# EAGLE design pi_shield_R4 (EAGLE 6.4)
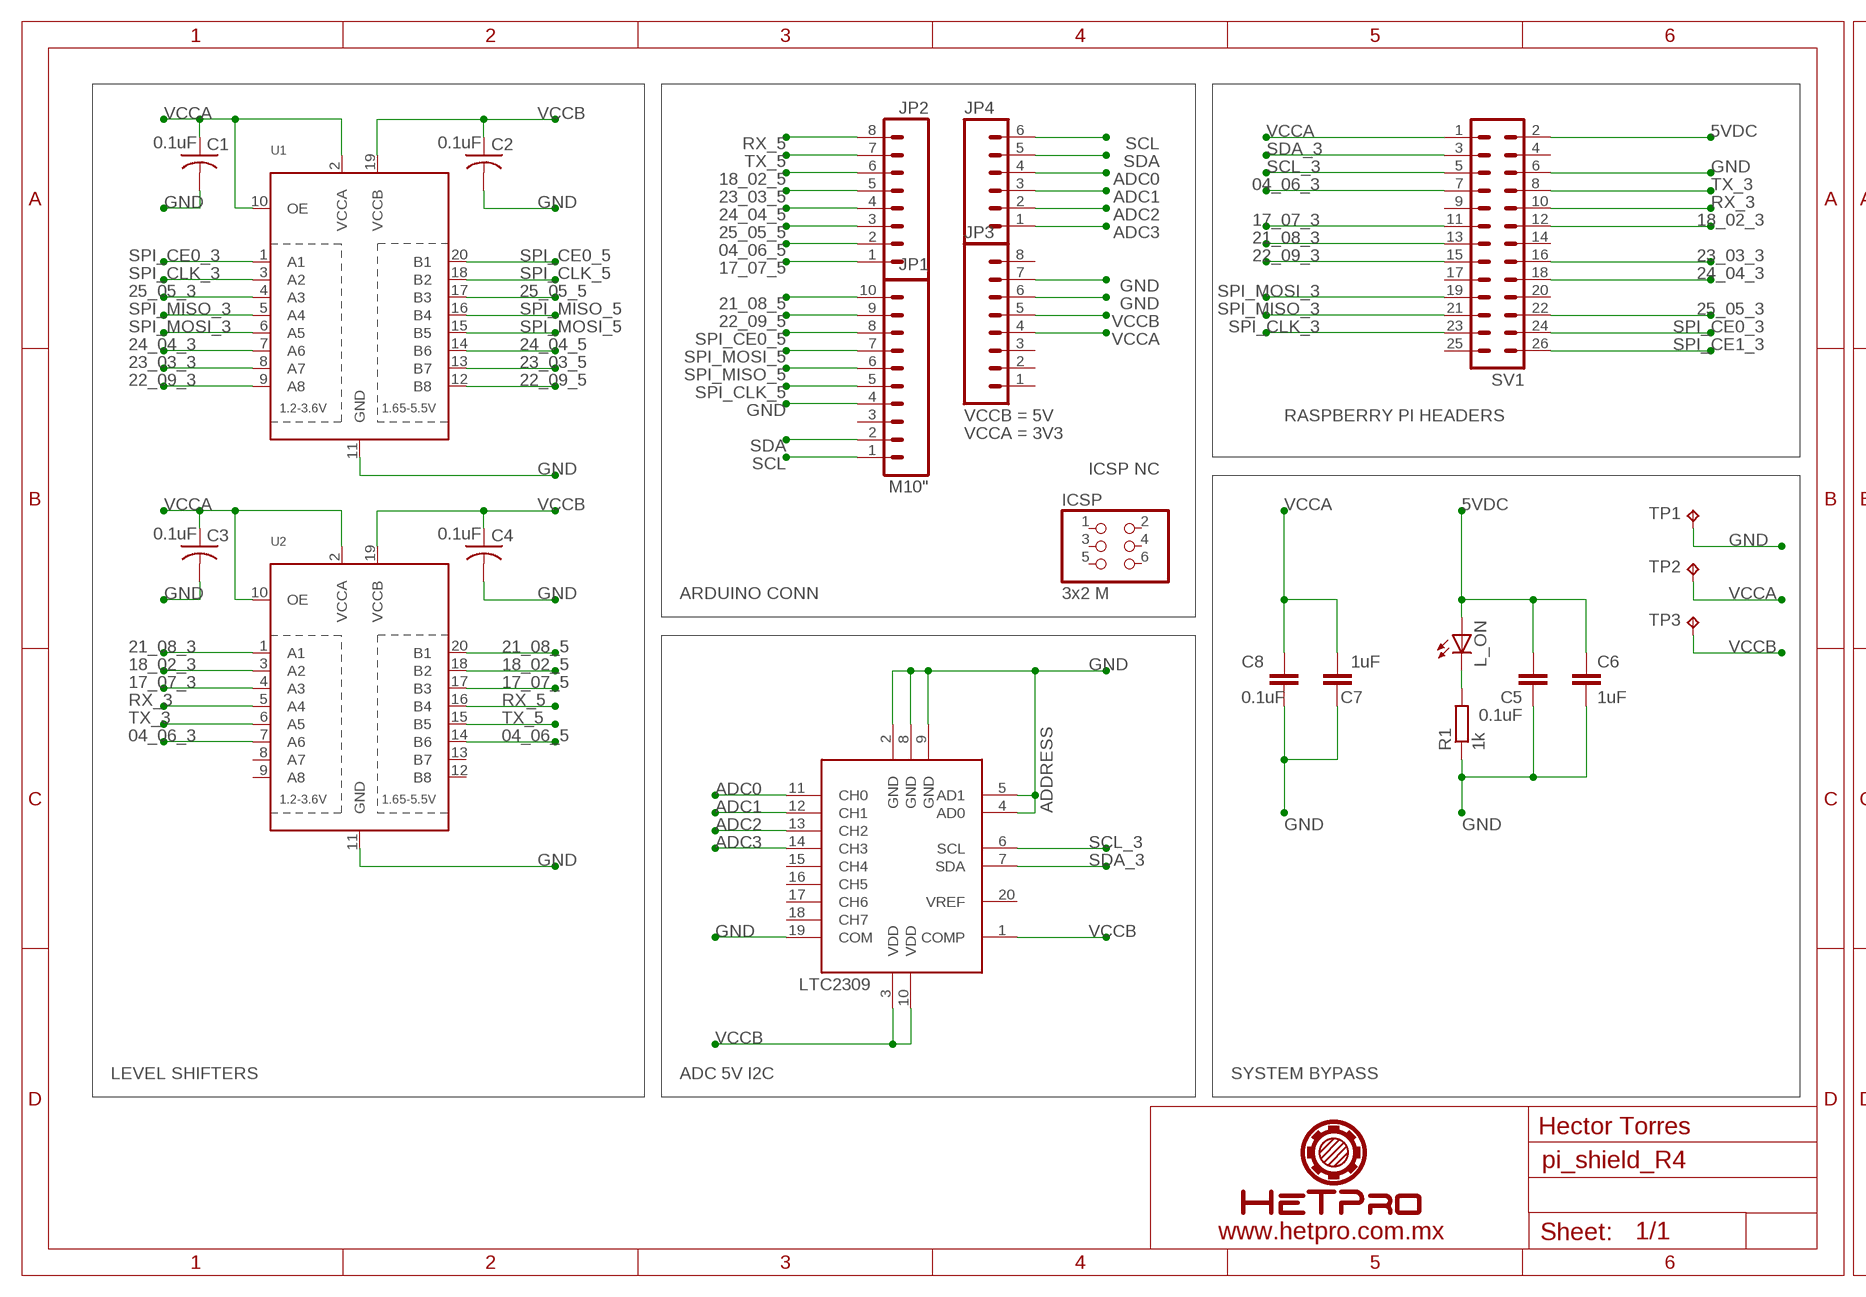
[diagram p0: schematic, sheet 1, part 1 of 2]
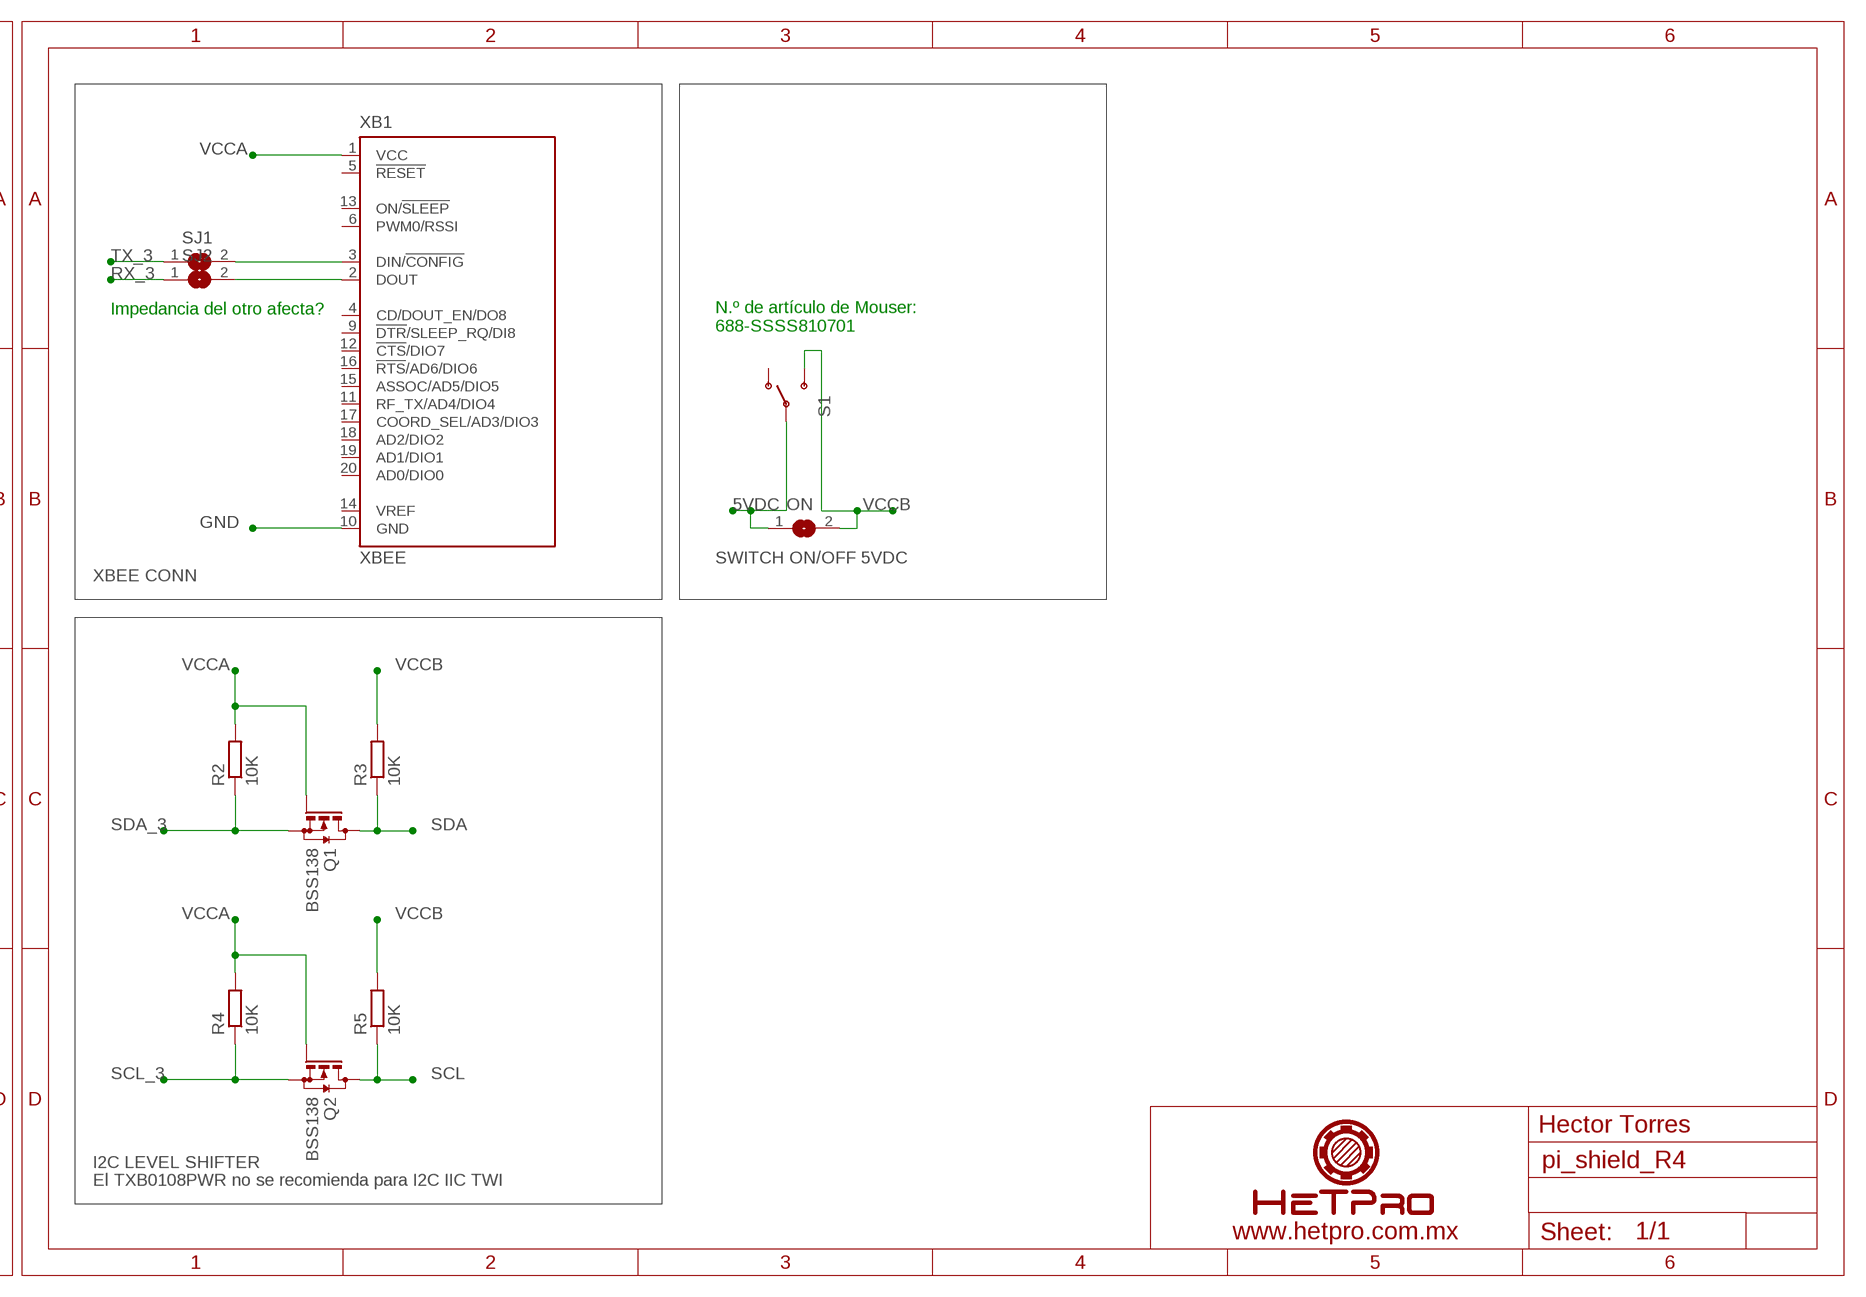
[diagram p1: schematic, sheet 1, part 2 of 2]

## Parts
C1  0.1uF  C-USC0603  [C0603]
C2  0.1uF  C-USC0603  [C0603]
C3  0.1uF  C-USC0603  [C0603]
C4  0.1uF  C-USC0603  [C0603]
C5  0.1uF  C-EUC0603  [C0603]
C6  1uF  C-EUC1206  [C1206]
C7  1uF  C-EUC0603  [C0603]
C8  0.1uF  C-EUC1206  [C1206]
ICSP  3x2 M  PINHD-2X3  [2X03]
JP1  M10"  [1X10]
JP2  M081X08  [1X08]
JP3  M081X08  [1X08]
JP4  M06SIP  [1X06]
L_ON  LEDCHIPLED_1206  [CHIPLED_1206]
ON  SJ  [SJ]
Q1  BSS138  BSS123  [SOT23]
Q2  BSS138  BSS123  [SOT23]
R1  1k  R-EU_R0603  [R0603]
R2  10K  R-EU_R0603  [R0603]
R3  10K  R-EU_R0603  [R0603]
R4  10K  R-EU_R0603  [R0603]
R5  10K  R-EU_R0603  [R0603]
S1  SWITCH-SPST-SMD-A  [SWITCH-SPST-SMD-A]
SJ1  SJ  [SJ]
SJ2  SJ  [SJ]
SV1  MA13-2  [MA13-2]
TP1  TPTP20SQ  [TP20SQ]
TP2  TPTP20SQ  [TP20SQ]
TP3  TPTP20SQ  [TP20SQ]
U1  TXB0108PWR  [TSSOP20]
U2  TXB0108PWR  [TSSOP20]
U$4  LTC2309  LTC2309_TSSOP20  [TSSOP20]
XB1  XBEE  [XBEE]

## Nets
04_06_3: SV1.7 U2.7(A6)
04_06_5: JP2.2 U2.14(B6)
5VDC: C5.2 C6.1 L_ON.A ON.1 S1.2(P) SV1.2
17_07_3: SV1.11 U2.4(A3)
17_07_5: JP2.1 U2.17(B3)
18_02_3: SV1.12 U2.3(A2)
18_02_5: JP2.6 U2.18(B2)
21_08_3: SV1.13 U2.1(A1)
21_08_5: JP1.10 U2.20(B1)
22_09_3: SV1.15 U1.9(A8)
22_09_5: JP1.9 U1.12(B8)
23_03_3: SV1.16 U1.8(A7)
23_03_5: JP2.5 U1.13(B7)
24_04_3: SV1.18 U1.7(A6)
24_04_5: JP2.4 U1.14(B6)
25_05_3: SV1.22 U1.4(A3)
25_05_5: JP2.3 U1.17(B3)
ADC0: JP4.4 U$4.11(CH0)
ADC1: JP4.3 U$4.12(CH1)
ADC2: JP4.2 U$4.13(CH2)
ADC3: JP4.1 U$4.14(CH3)
GND: C1.2 C2.2 C3.2 C4.2 C5.1 C6.2 C7.1 C8.2 JP1.4 JP3.6 JP3.7 R1.1 SV1.6 TP1.TP U1.11(GND) U2.11(GND) U$4.2(GND) U$4.4(AD0) U$4.5(AD1) U$4.8(GND) U$4.9(GND) U$4.19(COM) XB1.10(GND)
N$64: SJ1.2 XB1.3(DIN/!CONFIG)
N$125: SJ2.2 XB1.2(DOUT)
N$129: L_ON.C R1.2
RX_3: SJ2.1 SV1.10 U2.5(A4)
RX_5: JP2.8 U2.16(B4)
SCL: JP1.1 JP4.6 Q2.3(D) R5.1
SCL_3: Q2.2(S) R4.1 SV1.5 U$4.6(SCL)
SDA: JP1.2 JP4.5 Q1.3(D) R3.1
SDA_3: Q1.2(S) R2.1 SV1.3 U$4.7(SDA)
SPI_CE0_3: SV1.24 U1.1(A1)
SPI_CE0_5: JP1.8 U1.20(B1)
SPI_CE1_3: SV1.26
SPI_CLK_3: SV1.23 U1.3(A2)
SPI_CLK_5: JP1.5 U1.18(B2)
SPI_MISO_3: SV1.21 U1.5(A4)
SPI_MISO_5: JP1.6 U1.16(B4)
SPI_MOSI_3: SV1.19 U1.6(A5)
SPI_MOSI_5: JP1.7 U1.15(B5)
TX_3: SJ1.1 SV1.8 U2.6(A5)
TX_5: JP2.7 U2.15(B5)
VCCA: C1.1 C3.1 C7.2 C8.1 JP3.4 Q1.1(G) Q2.1(G) R2.2 R4.2 SV1.1 TP2.TP U1.2(VCCA) U1.10(OE) U2.2(VCCA) U2.10(OE) XB1.1(VCC)
VCCB: C2.1 C4.1 JP3.5 ON.2 R3.2 R5.2 S1.3(S) TP3.TP U1.19(VCCB) U2.19(VCCB) U$4.1(COMP) U$4.3(VDD) U$4.10(VDD)
Unconnected: ICSP.1 ICSP.2 ICSP.3 ICSP.4 ICSP.5 ICSP.6 JP1.3 JP3.1 JP3.2 JP3.3 JP3.8 S1.1(O) SV1.4 SV1.9 SV1.14 SV1.17 SV1.20 SV1.25 U2.8(A7) U2.9(A8) U2.12(B8) U2.13(B7) U$4.15(CH4) U$4.16(CH5) U$4.17(CH6) U$4.18(CH7) U$4.20(VREF) XB1.4(CD/DOUT_EN/DO8) XB1.5(!RESET) XB1.6(PWM0/RSSI) XB1.9(!DTR!/SLEEP_RQ/DI8) XB1.11(RF_TX/AD4/DIO4) XB1.12(!CTS!/DIO7) XB1.13(ON/!SLEEP) XB1.14(VREF) XB1.15(ASSOC/AD5/DIO5) XB1.16(!RTS!/AD6/DIO6) XB1.17(COORD_SEL/AD3/DIO3) XB1.18(AD2/DIO2) XB1.19(AD1/DIO1) XB1.20(AD0/DIO0)

## Notes on the sheet
- Impedancia del otro afecta?
- N.º de artículo de Mouser:
  688-SSSS810701
- VCCB = 5V | RASPBERRY PI HEADERS
- VCCA = 3V3
- ICSP NC
- SWITCH ON/OFF 5VDC
- XBEE CONN
- ARDUINO CONN
- ADDRESS
- LEVEL SHIFTERS | ADC 5V I2C | SYSTEM BYPASS
- Hector Torres | Hector Torres
- I2C LEVEL SHIFTER
- El TXB0108PWR no se recomienda para I2C IIC TWI
- www.hetpro.com.mx | www.hetpro.com.mx

## Library data of the parts
C1-C4 = adafruit:C-US: CAPACITOR, American symbol
C5-C8 = rcl:C-EU: CAPACITOR, European symbol
ICSP = SmartPrj:PINHD-2X3: PIN HEADER
JP1 = SparkFun:M10: Header 10 Standard 10-pin 0.1" header. Use with straight break away headers (SKU : PRT-00116), right angle break away headers (PRT-00553), swiss pins (PRT-00743), machine pins (PRT-00117), and female headers (PRT-00115).
JP2 JP3 = SparkFun:M08: Header 8 Standard 8-pin 0.1" header. Use with straight break away headers (SKU : PRT-00116), right angle break away headers (PRT-00553), swiss pins (PRT-00743), machine pins (PRT-00117), and female headers (PRT-00115).
JP4 = SparkFun:M06: Header 6 Standard 6-pin 0.1" header. Use with straight break away headers (SKU : PRT-00116), right angle break away headers (PRT-00553), swiss pins (PRT-00743), machine pins (PRT-00117), and female headers (PRT-00115). Molex polarized connector foot print use with SKU : PRT-08094 with associated crimp pins and housings. NOTES ON THE VARIANTS LOCK and LOCK_LONGPADS... This footprint was designed to help hold the alignment of a through-hole component (i.e. 6-pin header) while soldering it into place. You may notice that each hole has been shifted either up or down by 0.005 of an inch from it's more standard position (which is a perfectly straight line). This slight alteration caused the pins (the squares in the middle) to touch the edges of the holes. Because they are alternating, it causes a "brace" to hold the component in place. 0.005 has proven to be the perfect amount of "off-center" position when using our standard breakaway headers. Although looks a little odd when you look at the bare footprint, once you have a header in there, the alteration is very hard to notice. Also, if you push a header all the way into place, it is covered up entirely on the bottom side. This idea of altering the position of holes to aid alignment will be further integrated into the Sparkfun Library for other footprints. It can help hold any component with 3 or more connection pins.
L_ON = led:LED: LED OSRAM: - CHIPLED LG R971, LG N971, LY N971, LG Q971, LY Q971, LO R971, LY R971 LH N974, LH R974 LS Q976, LO Q976, LY Q976 LO Q996 - Hyper CHIPLED LW Q18S LB Q993, LB Q99A, LB R99A - SideLED LS A670, LO A670, LY A670, LG A670, LP A670 LB A673, LV A673, LT A673, LW A673 LH A674 LY A675 LS A676, LA A676, LO A676, LY A676, LW A676 LS A679, LY A679, LG A679 - Hyper Micro SIDELED® LS Y876, LA Y876, LO Y876, LY Y876 LT Y87S - SmartLED LW L88C, LW L88S LB L89C, LB L89S, LG L890 LS L89K, LO L89K, LY L89K LS L896, LA L896, LO L896, LY L896 - TOPLED LS T670, LO T670, LY T670, LG T670, LP T670 LSG T670, LSP T670, LSY T670, LOP T670, LYG T670 LG T671, LOG T671, LSG T671 LB T673, LV T673, LT T673, LW T673 LH T674 LS T676, LA T676, LO T676, LY T676, LB T676, LH T676, LSB T676, LW T676 LB T67C, LV T67C, LT T67C, LS T67K, LO T67K, LY T67K, LW E67C LS E67B, LA E67B, LO E67B, LY E67B, LB E67C, LV E67C, LT E67C LW T67C LS T679, LY T679, LG T679 LS T770, LO T770, LY T770, LG T770, LP T770 LB T773, LV T773, LT T773, LW T773 LH T774 LS E675, LA E675, LY E675, LS T675 LS T776, LA T776, LO T776, LY T776, LB T776 LHGB T686 LT T68C, LB T68C - Hyper Mini TOPLED® LB M676 - Mini TOPLED Santana® LG M470 LS M47K, LO M47K, LY M47K Source: http://www.osram.convergy.de LUXEON: - LUMILED® LXK2-PW12-R00, LXK2-PW12-S00, LXK2-PW14-U00, LXK2-PW14-V00 LXK2-PM12-R00, LXK2-PM12-S00, LXK2-PM14-U00 LXK2-PE12-Q00, LXK2-PE12-R00, LXK2-PE12-S00, LXK2-PE14-T00, LXK2-PE14-U00 LXK2-PB12-K00, LXK2-PB12-L00, LXK2-PB12-M00, LXK2-PB14-N00, LXK2-PB14-P00, LXK2-PB14-Q00 LXK2-PR12-L00, LXK2-PR12-M00, LXK2-PR14-Q00, LXK2-PR14-R00 LXK2-PD12-Q00, LXK2-PD12-R00, LXK2-PD12-S00 LXK2-PH12-R00, LXK2-PH12-S00 LXK2-PL12-P00, LXK2-PL12-Q00, LXK2-PL12-R00 Source: www.luxeon.com KINGBRIGHT: KA-3528ASYC Source: www.kingbright.com
ON SJ1 SJ2 = jumper:SJ: SMD solder JUMPER
Q1 Q2 = transistor-small-signal:BSS123: N-CHANNEL MOS FET
R1-R5 = resistor:R-EU_: RESISTOR, European symbol
S1 = SparkFun:SWITCH-SPST: SPST Switch Simple slide switch. Spark Fun Electronics SKU : COM-00102
SV1 = con-lstb:MA13-2: PIN HEADER; OC_FARNELL: unknown; OC_NEWARK: unknown
TP1-TP3 = testpad:TP: Test pad
U1 U2 = adafruit:TXB0108PWR: 8-Bit Bi-Directional Level Shifter 1.2V-3.6V (VCCA) to 1.65V-5.5V (VCCB) bi-directional level shifter with auto direction sensing. Max data rate - VCCA 1.8V: 20Mbps (50ns), VCCA 3.3V: 100Mbps (10ns) Digikey: 296-21527-1-ND
U$4 = HeTPro:LTC2309_TSSOP20: TheLTC® 2309is a lownoise,lowpower,8-channel,12-bit successive approximation ADC with an I2C compatible serial interface. This ADC includes an internal reference and a fully differential sample-and-hold circuit to reduce common mode noise. The LTC2309 operates from an internal clock to achieve a fast 1.3µs conversion time
XB1 = maxstream2:XBEE: XBee (TM) /XBee-PRO(TM) OEM RF Modules Source: MaxStream, Inc. xbee_productmanual.pdf; MPN: XBP24-Z7UIT-004; OC_FARNELL: 1751799; OC_NEWARK: 34R5507

## Board
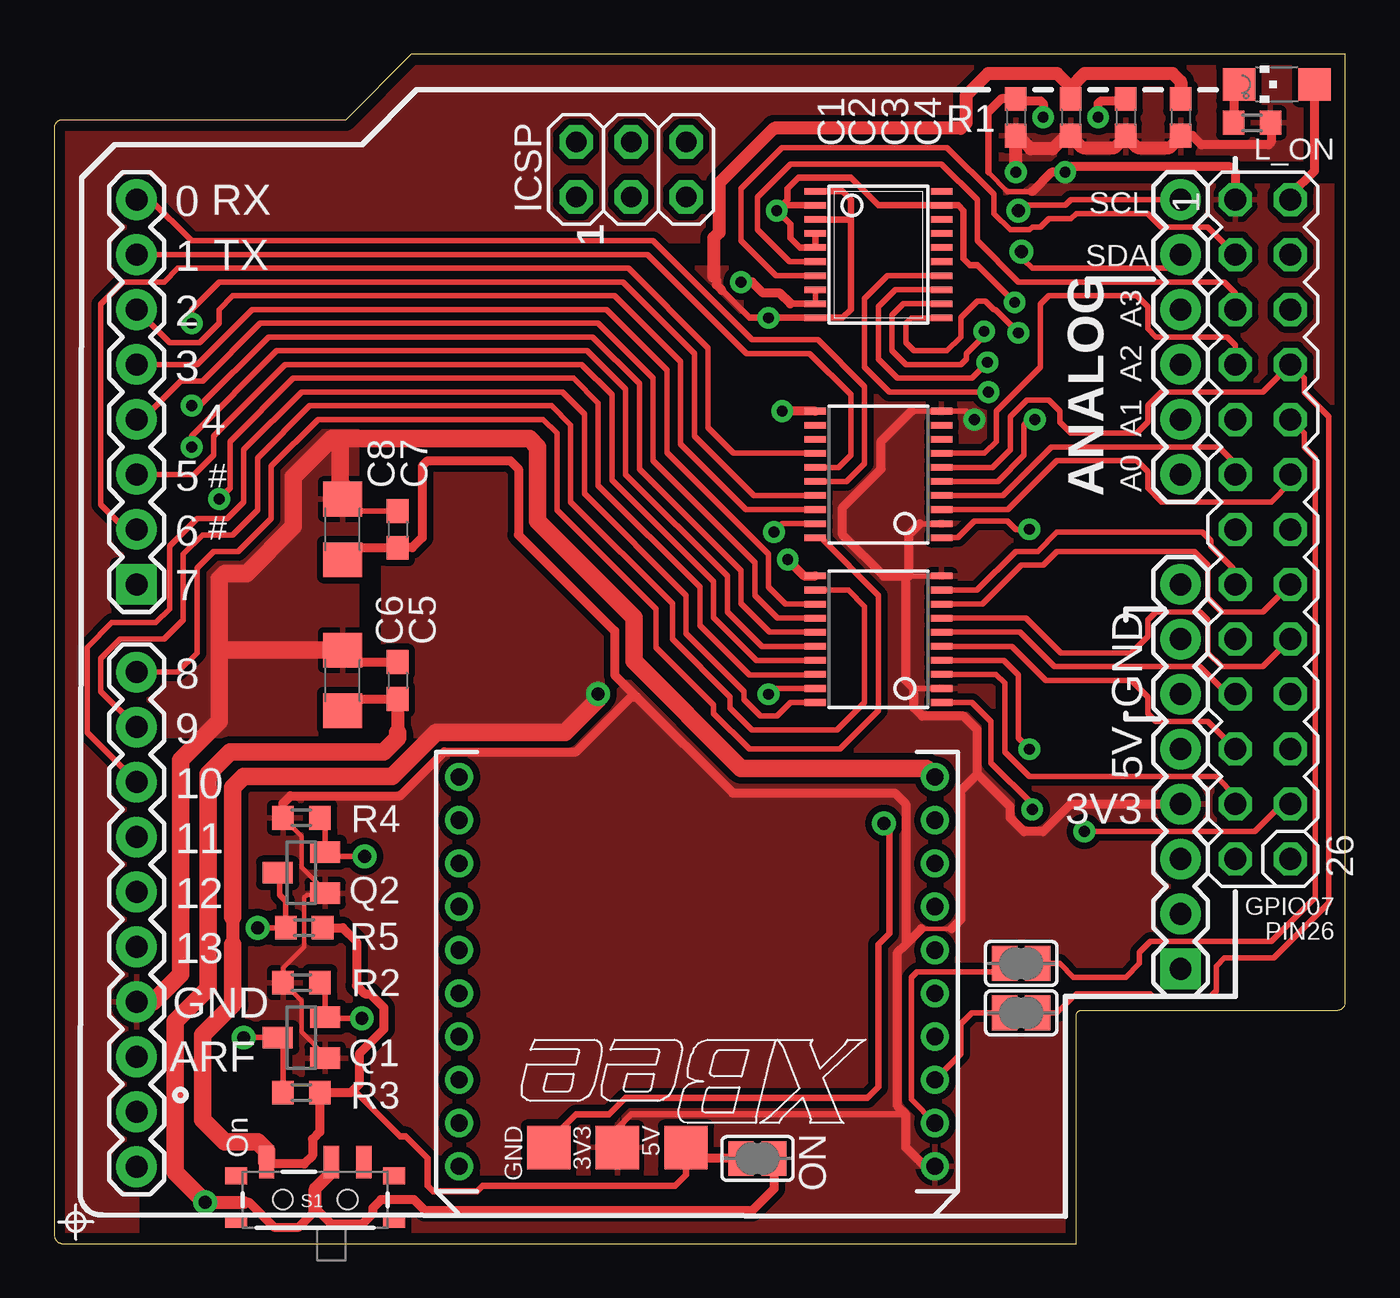
[diagram p2: board, top side]
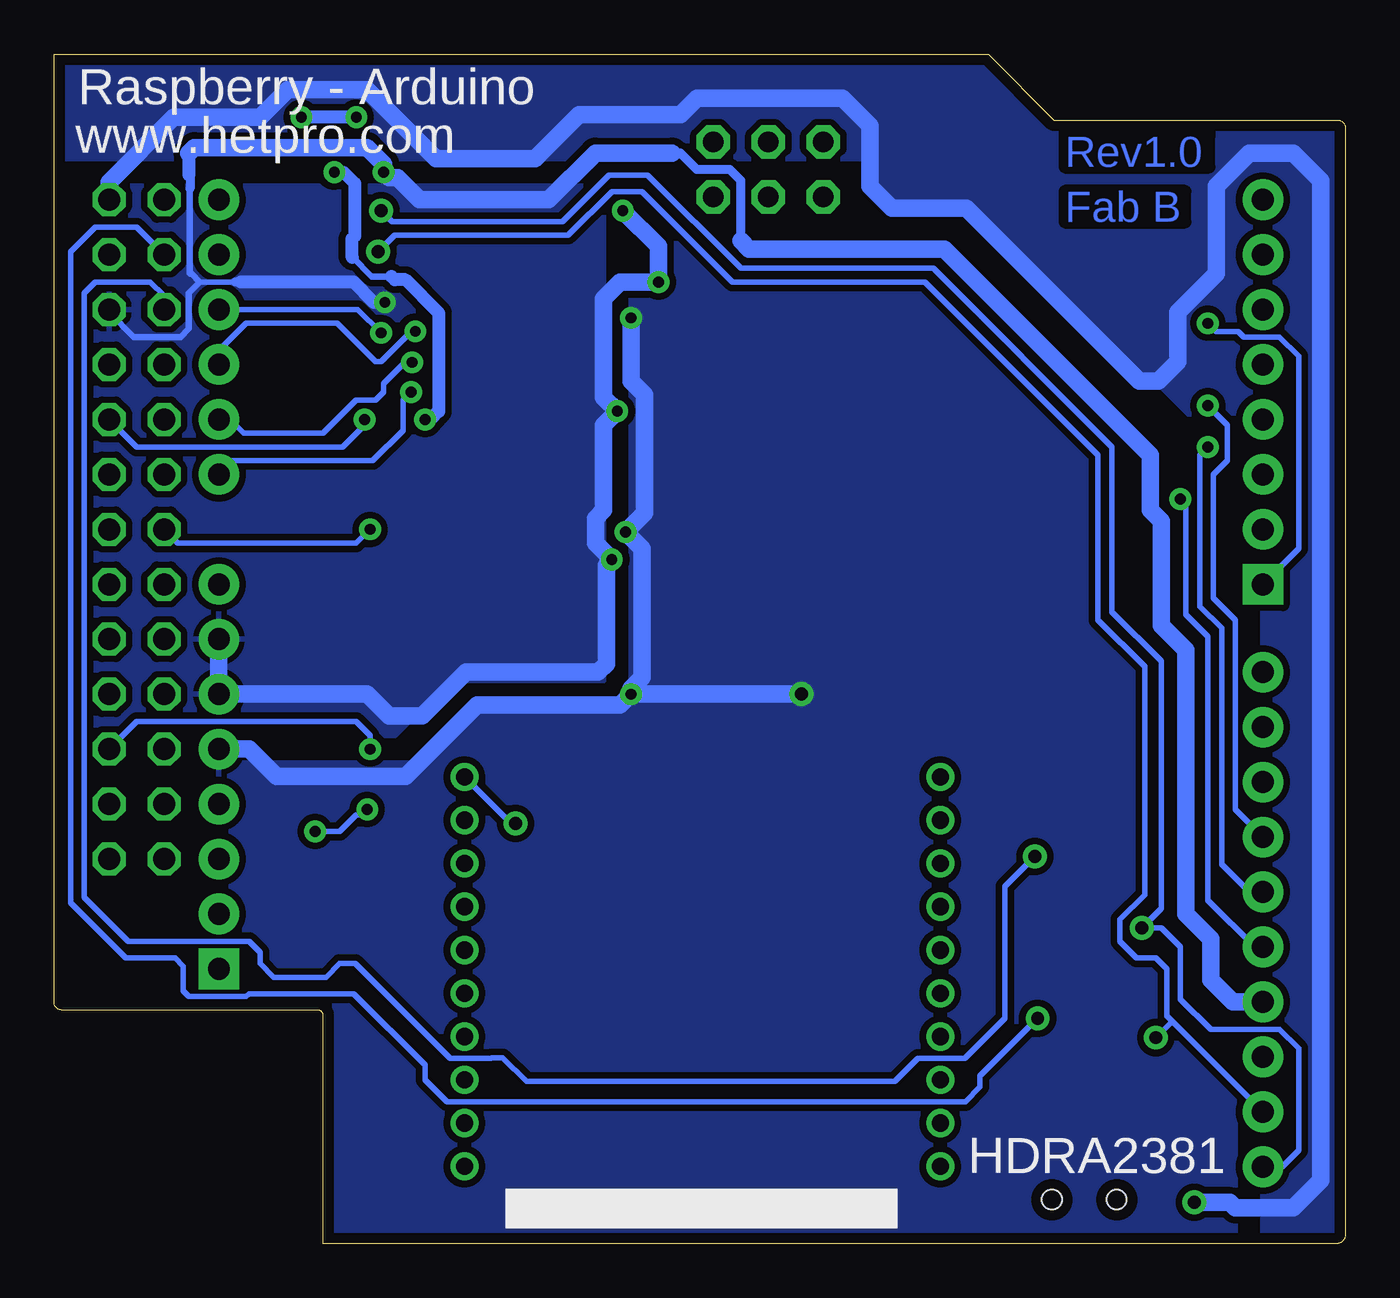
[diagram p3: board, bottom side, seen from below]

Size 59.69 x 54.99 mm. Coordinates in mm from the lower left corner, seen from the top.
Outline: 59.69,11.15 59.69,54.99 16.51,54.99 13.47,51.94 0.36,51.94 arc90 0,51.58 0,0.49 arc90 0.36,0 47.25,0 47.25,10.54 arc-90 47.5,10.79 59.34,10.79 arc90 59.69,11.15
Copper layers (1*16): Top 0.035mm / dielectric 1.5mm / Bottom 0.035mm
Design rules "HeTPro_iTEAD *": minimum track width 0.2mm, minimum drill 0.4mm, track to track 0.2mm, track to pad 0.2mm, pad to pad 0.2mm, via to via 0.2mm, smd to smd 0.2mm, copper to edge 0.5mm, drill to drill 0.5mm, minimum pad ring 10mil, minimum via ring 10mil, stop-mask expansion 4mil, vias tented up to drill 0mil, thermal gap 10mil

### Footprints (pad centres in the part's own frame; a part is rotated, then mirrored left to right if it is on the bottom)
C0603 = smd 1.1 x 1: 1 -0.85,0; 2 0.85,0
C1206 = smd 1.6 x 1.8: 1 -1.4,0; 2 1.4,0
2X03 = drill 0.95 pad 1.55 octagon: 1 -2.54,-1.27; 2 -2.54,1.27; 3 0,-1.27; 4 0,1.27; 5 2.54,-1.27; 6 2.54,1.27
1X10 = drill 1.016 pad 1.88: 1 0,0; 2 2.54,0; 3 5.08,0; 4 7.62,0; 5 10.16,0; 6 12.7,0; 7 15.24,0; 8 17.78,0; 9 20.32,0; 10 22.86,0
1X08 = drill 1.016 pad 1.88 square: 1 0,0 | drill 1.016 pad 1.88: 2 2.54,0; 3 5.08,0; 4 7.62,0; 5 10.16,0; 6 12.7,0; 7 15.24,0; 8 17.78,0
1X06 = drill 1.016 pad 1.88: 1 0,0; 2 2.54,0; 3 5.08,0; 4 7.62,0; 5 10.16,0; 6 12.7,0
CHIPLED_1206 = smd 1.5 x 1.5: A 0,-1.75; C 0,1.75
SJ = smd 1.168 x 1.6: 1 -0.762,0; 2 0.762,0
SOT23 = smd 1 x 1.4: 1 -0.95,-1.1; 2 0.95,-1.1; 3 0,1.1
R0603 = smd 1 x 1.1: 1 -0.85,0; 2 0.85,0
SWITCH-SPST-SMD-A = smd 0.7 x 1.5: 1 -2.25,-1.75; 2 -0.75,-1.75; 3 2.25,-1.75 | smd 1 x 0.6: GND1 -3.65,1; GND3 3.65,1 | smd 1 x 0.8: GND2 -3.65,-1.1; GND4 3.65,-1.1 | hole 0.9: -1.5,0; 1.5,0
MA13-2 = drill 1.016 octagon: 1 -15.24,-1.27; 2 -15.24,1.27; 3 -12.7,-1.27; 4 -12.7,1.27; 5 -10.16,-1.27; 6 -10.16,1.27; 7 -7.62,-1.27; 8 -7.62,1.27; 9 -5.08,-1.27; 10 -5.08,1.27; 11 -2.54,-1.27; 12 -2.54,1.27; 13 0,-1.27; 14 0,1.27; 15 2.54,-1.27; 16 2.54,1.27; 17 5.08,-1.27; 18 5.08,1.27; 19 7.62,-1.27; 20 7.62,1.27; 21 10.16,-1.27; 22 10.16,1.27; 23 12.7,-1.27; 24 12.7,1.27; 25 15.24,-1.27; 26 15.24,1.27
TP20SQ = smd 2 x 2: TP 0,0
TSSOP20 = smd 0.305 x 0.991: 1 -2.925,-2.918; 2 -2.275,-2.918; 3 -1.625,-2.918; 4 -0.975,-2.918; 5 -0.325,-2.918; 6 0.325,-2.918; 7 0.975,-2.918; 8 1.625,-2.918; 9 2.275,-2.918; 10 2.925,-2.918; 11 2.925,2.918; 12 2.275,2.918; 13 1.625,2.918; 14 0.975,2.918; 15 0.325,2.918; 16 -0.325,2.918; 17 -0.975,2.918; 18 -1.625,2.918; 19 -2.275,2.918; 20 -2.925,2.918
XBEE = drill 0.8 pad 1.27: 1 -11,9; 2 -11,7; 3 -11,5; 4 -11,3; 5 -11,1; 6 -11,-1; 7 -11,-3; 8 -11,-5; 9 -11,-7; 10 -11,-9; 11 11,-9; 12 11,-7; 13 11,-5; 14 11,-3; 15 11,-1; 16 11,1; 17 11,3; 18 11,5; 19 11,7; 20 11,9

### Placement (x,y rotation side)
C1  44.45,52.07 270 top
C2  46.99,52.07 270 top
C3  49.53,52.07 270 top
C4  52.07,52.07 270 top
C5  15.88,26.04 270 top
C6  13.34,26.04 90 top
C7  15.88,33.02 270 top
C8  13.34,33.02 90 top
ICSP  26.67,49.66 0 top
JP1  3.81,3.56 90 top
JP2  3.81,30.48 90 top
JP3  52.07,12.7 90 top
JP4  52.07,35.56 90 top
L_ON  56.52,53.59 90 top
ON  32.52,3.94 180 top
Q1  11.43,9.53 90 top
Q2  11.43,17.14 90 top
R1  55.38,51.82 180 top
R2  11.43,12.06 180 top
R3  11.43,6.99 0 top
R4  11.43,19.68 180 top
R5  11.56,14.61 0 top
S1  12.07,2.03 180 top
SJ1  44.71,10.67 180 top
SJ2  44.71,12.95 180 top
SV1  55.88,33.02 270 top
TP1  22.86,4.45 0 top
TP2  26.04,4.45 0 top
TP3  29.21,4.45 0 top
U1  38.1,27.94 90 top
U2  38.1,35.56 90 top
U$4  38.1,45.72 270 top
XB1  29.72,12.57 180 top

### Tracks (layer width: path | path; a pad name or v marks a point on that pad's centre or on a via)
04_06_3
  Top 0.254: U2.7 43.02,36.53 43.57,37.08 43.57,38.48 45.6,40.51 45.6,43.43 45.98,43.81 50.04,43.81 50.55,43.31 50.55,42.29 50.93,41.91 54.23,41.91 54.61,41.53 SV1.7
04_06_5
  Top 0.254: JP2.2 3.31,33.02 2.16,34.16 2.16,43.43 3.18,44.45 5.08,44.45 5.72,45.09 26.55,45.09 30.23,41.4 30.23,37.72 31.41,36.53 U2.14
5VDC  (via drill 0.6)
  Top 0.254: C6.1 13.89,25.18 | 12.83,3.77 S1.2
  Top 0.406: 13.89,25.18 C5.2 | 8.77,1.91 9.02,1.91 10.16,0.76 11.31,0.76 12.07,1.52 12.2,1.52 12.83,0.89 14.23,0.89 14.74,1.4 14.74,1.65 15.12,2.03 16.64,2.03 17.15,1.52 32.26,1.52 33.28,2.54 ON.1 | 57.15,48.48 58.27,49.59 L_ON.A
  Top 0.61: C5.2 15.88,23.62 | 57.15,48.48 SV1.2 | 12.07,1.52 12.07,2.54 12.82,3.29 S1.2 | v6.99,1.91 8.77,1.91
  Top 0.813: 15.88,23.62 15.88,23.37 15.24,22.73 8.13,22.73 7.12,21.72 7.12,11.81 5.59,10.29 5.59,3.3 v6.99,1.91
  Bottom 0.813: v6.99,1.91 5.34,1.91 5.08,1.65 2.42,1.65 1.15,2.92 1.15,49.15 2.42,50.42 4.45,50.42 5.97,48.9 5.97,44.83 7.75,43.05 7.75,40.77 8.64,39.88 9.53,39.88 17.53,47.88 20.96,47.88 21.98,48.9 21.98,51.69 23.25,52.96 29.98,52.96 30.74,52.2 35.44,52.2 37.47,50.16 42.04,50.16 45.22,53.34 48.9,53.34 50.17,52.07 54.16,52.07 57.15,49.07 SV1.2
  pour Bottom (isolate 0.305): 3.81,0.13 3.81,34.92 16.51,47.62 20.32,47.62 21.59,48.9 21.59,50.16 59.69,50.16 59.69,54.99 16.51,54.99 13.47,51.94 0.36,51.94 arc90 0,51.58 0,0.49 arc90 0.36,0.13
17_07_3
  Top 0.254: U2.4 43.86,34.59 46.11,36.83 53.85,36.83 54.61,36.07 SV1.11
17_07_5  (via drill 0.5 pad 0.25)
  Top 0.254: U2.17 32.35,34.59 29.6,37.34 29.6,41.15 26.29,44.45 7.62,44.45 6.35,43.18 v6.35,42.55
  Bottom 0.254: v6.35,42.55 5.97,42.16 4.96,42.16 4.7,41.91 3.05,41.91 2.16,41.02 2.16,32.13 JP2.1
18_02_3
  Top 0.254: U2.3 44.1,33.94 46.36,36.2 50.04,36.2 50.55,35.69 50.55,34.92 51.19,34.29 56.27,34.29 57.15,35.18 SV1.12
18_02_5
  Top 0.254: U2.18 31.98,33.94 28.96,36.96 28.96,40.77 25.91,43.81 8.26,43.81 7.62,43.18 7.62,42.55 6.74,41.66 5.34,41.66 JP2.6
21_08_3  (via drill 0.5 pad 0.25)
  Top 0.254: U2.1 41.78,32.63 42.55,33.4 44.07,33.4 44.45,33.02 v45.09,33.02
  Bottom 0.254: v45.09,33.02 45.72,32.38 53.98,32.38 SV1.13
21_08_5
  Top 0.254: JP1.10 5.72,26.42 6.61,27.3 6.61,31.24 7.37,32 8.51,32 10.04,33.53 10.04,35.94 12.2,38.1 22.61,38.1 23.25,37.47 23.25,33.91 27.82,29.34 27.82,27.56 30.48,24.89 30.48,24.51 32.14,22.86 36.33,22.86 38.1,24.64 38.1,29.97 35.44,32.63 U2.20
22_09_3
  Top 0.254: U1.9 42.67,30.21 44.45,32 45.47,32 46.36,32.89 53.09,32.89 53.47,32.51 53.47,32.26 54.49,31.24 54.49,30.61 SV1.15
22_09_5
  Top 0.254: U1.12 36.72,30.21 37.47,29.46 37.47,25.02 36.2,23.75 32.26,23.75 31.25,24.77 31.25,25.27 28.58,27.94 28.58,29.59 23.88,34.29 23.88,37.85 22.99,38.73 11.82,38.73 9.4,36.32 9.4,33.91 8.26,32.77 6.86,32.77 5.97,31.88 5.97,28.83 5.08,27.94 3.05,27.94 2.16,27.05 2.16,25.53 JP1.9
23_03_3
  Top 0.254: U1.8 42.9,29.57 44.71,31.37 45.72,31.37 46.36,32 52.71,32 53.34,31.37 53.34,29.84 53.98,29.21 55.88,29.21 SV1.16
23_03_5
  Top 0.254: U1.13 33.81,29.57 33.02,30.35 33.02,31.88 28.33,36.58 28.33,40.39 25.53,43.18 9.15,43.18 6.61,40.64 JP2.5
24_04_3
  Top 0.254: U1.7 44.92,28.91 46.53,27.3 49.79,27.3 50.55,28.07 50.55,28.83 50.93,29.21 52.96,29.21 53.34,28.83 53.34,27.3 53.98,26.67 55.88,26.67 SV1.18
24_04_5
  Top 0.254: U1.14 33.45,28.91 32.39,29.97 32.39,31.5 27.69,36.2 27.69,40.01 25.15,42.55 9.53,42.55 6.86,39.88 5.85,39.88 4.07,38.1 JP2.4
25_05_3  (via drill 0.5 pad 0.25)
  Top 0.254: v45.09,22.86 44.58,23.37 44.58,26.29 43.91,26.96 U1.4
  Bottom 0.254: v45.09,22.86 45.09,23.5 45.72,24.13 55.88,24.13 SV1.22
25_05_5
  Top 0.254: U1.17 32.48,26.96 30.48,28.96 30.48,30.61 25.79,35.31 25.79,39.24 24.39,40.64 10.67,40.64 7.37,37.34 7.37,36.45 6.48,35.56 JP2.3
ADC0  (via drill 0.5 pad 0.25)
  Top 0.254: U$4.11 39.62,42.8 39.37,42.55 39.37,41.66 39.76,41.27 41.28,41.27 41.91,41.91 41.91,42.8 42.68,43.56 43.06,43.56 43.44,43.18 43.51,43.18 v44.58,42.1
  Bottom 0.254: JP4.4 45.66,43.18 v44.58,42.1
ADC1  (via drill 0.5 pad 0.25)
  Top 0.254: U$4.12 39.26,43.45 38.74,42.93 38.74,41.27 39.37,40.64 41.91,40.64 42.17,40.89 42.17,41.15 43,41.98 v43,42.17
  Bottom 0.254: JP4.3 52.07,41.27 50.8,42.55 46.61,42.55 44.84,40.77 44.58,40.77 43.17,42.17 v43,42.17
ADC2  (via drill 0.5 pad 0.25)
  Top 0.254: U$4.13 38.89,44.09 38.1,43.31 38.1,40.89 38.99,40.01 42.42,40.01 43.14,40.72 v43.14,40.74
  Bottom 0.254: JP4.2 51.57,38.1 50.93,37.47 47.25,37.47 45.72,38.99 44.84,38.99 44.45,39.37 44.45,39.75 43.46,40.74 v43.14,40.74
ADC3  (via drill 0.5 pad 0.25)
  Top 0.254: U$4.14 38.53,44.74 37.47,43.69 37.47,40.51 38.61,39.37 v43.18,39.37
  Bottom 0.254: v43.18,39.37 43.57,38.99 43.57,37.59 44.96,36.2 51.44,36.2 JP4.1
GND  (via drill 0.5, 0.5 pad 0.25, 0.6)
  Top 0.254: v33.66,38.48 | U$4.8 U$4.9 | 33.65,47.99 v33.41,47.75 | C7.1 13.89,33.87 C8.2 13.72,34.8 | 13.89,26.89 C6.2 13.08,27.18
  Top 0.305: U$4.9 34.03,43.45 | U$4.2 33.65,47.99 | U$4.4 U$4.5 34.48,46.05 34.04,46.48 34.04,47.12 v33.41,47.75 33.91,48.26 33.91,48.77 34.42,49.28 36.83,49.28 38.12,47.99 U$4.19 41.8,47.99 42.04,47.75 42.04,45.54 42.34,45.24 42.68,45.24 v44.4,43.51 | TP1.TP 22.86,4.7 24.13,5.97 25.66,5.97 26.42,6.73 37.6,6.73 38.1,7.24 38.1,13.84 38.61,14.35 38.61,19.18 v38.36,19.43
  Top 0.406: U2.11 v33.66,38.48 | 34.03,43.45 33.53,43.94 32.77,43.94 32.26,44.45 v31.75,44.45 | C4.2 52.62,51.22 53.04,50.8 56.14,50.8 56.27,50.93 56.27,51.78 R1.1 | 13.89,26.89 C5.1 | v33.91,31.62 34.67,30.86 U1.11
  Top 0.61: C4.2 52.07,51.18 51.57,50.67 50.08,50.67 C3.2 49.53,51.18 49.03,50.67 47.54,50.67 C2.2 46.78,51.22 46.17,50.61 45.15,50.61 44.54,51.22 C1.2 v44.45,49.53 | 13.72,34.8 13.21,35.31 | 13.08,27.18 12.83,27.43
  Top 0.813: XB1.10 40.32,21.97 31.75,21.97 26.8,26.92 26.8,28.96 22.36,33.4 22.36,36.83 21.98,37.21 13.21,37.21 | 13.21,37.21 12.83,37.21 11.05,35.43 11.05,33.15 8.89,30.99 7.88,30.99 7.62,30.73 7.62,27.43 7.75,27.43 | 13.21,35.31 13.21,37.21 | 12.83,27.43 7.75,27.43 | JP1.4 4.58,11.18 5.85,12.45 5.85,22.35 7.62,24.13 7.62,27.3 7.75,27.43
  Bottom 0.254: 51.31,44.45 52.96,44.45
  Bottom 0.305: SV1.6 57.15,43.05 56.01,41.91 53.85,41.91 53.47,42.29 53.47,43.94 52.96,44.45 53.34,44.83 arc90 53.43,44.92 53.43,48.75 53.41,48.77 | v38.36,19.43 38.58,19.43 XB1.10
  Bottom 0.406: 27.94,46.35 27.94,49.15 28.45,49.66 29.98,49.66 30.74,50.42 31.12,50.42 | 51.06,44.45 51.31,44.45 | 53.47,49.53 53.41,49.47 53.41,48.77
  Bottom 0.61: v44.4,43.51 44.91,43.51 45.85,44.45 51.06,44.45 | 53.47,50.42 53.47,49.53 53.47,49.4
  Bottom 0.813: JP3.7 JP3.6 45.22,25.4 44.2,24.38 42.68,24.38 40.64,26.42 34.55,26.42 34.17,26.8 34.17,31.37 v33.91,31.62 34.68,32.38 34.68,33.53 34.29,33.91 34.29,37.85 v33.66,38.48 34.29,39.12 34.29,43.69 33.53,44.45 v31.75,44.45 31.75,46.1 v33.41,47.75 | 31.12,50.42 34.68,50.42 36.83,48.26 42.8,48.26 43.82,49.28 44.2,49.28 v44.45,49.53 44.45,49.91 45.22,50.67 53.22,50.67 53.47,50.42 | 27.94,46.35 27.56,45.97 18.55,45.97 9.02,36.45 9.02,33.91 8.51,33.4 8.51,28.57 7.37,27.43 7.37,15.24 6.23,14.1 6.23,12.19 5.21,11.18 JP1.4
  pour Top (isolate 0.305): 13.48,51.94 0.36,51.94 arc90 0,51.58 0,0.49 arc90 0.36,0.13 3.81,0.13 3.81,23.5 13.97,23.5 13.97,46.35 31.75,46.35 31.75,50.16 59.69,50.16 59.69,54.99 16.51,54.99
  pour Bottom (isolate 0.305): 34.29,26.04 34.29,48.9 59.69,48.9 59.69,23.5 43.95,23.5 41.41,26.04
N$64
  Top 0.254: XB1.3 41.41,8.26 41.91,8.76 41.91,10.16 42.42,10.67 SJ1.2
N$125
  Top 0.254: XB1.2 39.63,6.67 39.63,12.32 39.88,12.57 43.82,12.57
  Top 0.406: 43.82,12.57 43.82,12.83 SJ2.2
N$129
  Top 0.406: L_ON.C 54.53,53.35 R1.2
RX_3  (via drill 0.5 pad 0.25)
  Top 0.254: U2.5 43.62,35.23 44.84,36.45 44.84,37.85 45.09,38.1 v45.34,38.1 | SV1.10 57.79,37.47 57.79,36.83 58.3,36.32 58.3,16 56.27,13.97 50.68,13.97 50.17,13.46 50.17,12.95 49.53,12.32 47.12,12.32 46.49,12.95 SJ2.1
  Bottom 0.254: v45.34,38.1 45.34,37.85 46.36,36.83 55.88,36.83 SV1.10
RX_5
  Top 0.254: U2.16 36.64,35.23 37.47,36.07 37.47,39.62 35.31,41.78 32.26,41.78 27.69,46.35 6.35,46.35 4.45,48.26 JP2.8
SCL  (via drill 0.6)
  Top 0.254: v44.58,47.75 44.84,48.01 46.74,48.01 46.99,48.26 JP4.6 | 10.58,16.89 Q2.3 10.42,17.06 10.42,16.13 10.71,15.84 R5.1 v9.4,14.61
  Bottom 0.254: JP1.1 2.93,3.56 2.16,4.32 2.16,9.02 3.05,9.91 6.23,9.91 7.62,11.3 7.62,13.72 8.51,14.61 v9.4,14.61 8.51,15.49 8.51,26.92 10.8,29.21 10.8,36.83 19.05,45.09 27.94,45.09 32.26,49.4 34.04,49.4 36.2,47.24 44.07,47.24 v44.58,47.75
SCL_3  (via drill 0.6)
  Top 0.254: U$4.6 33.98,45.4 32.52,46.86 32.52,48.39 34.04,49.91 41.03,49.91 42.68,48.26 42.68,46.35 44.58,44.45 54.11,44.45 54.61,43.94 SV1.5 | v14.36,17.91 12.72,17.91 Q2.2 12.53,19.43 R4.1
  Bottom 0.254: v14.36,17.91 15.75,16.51 15.75,10.41 17.6,8.57 19.76,8.57 20.83,7.49 37.85,7.49 38.95,8.6 39.47,8.6 39.49,8.58 41.4,8.58 45.78,12.95 46.49,12.95 47.12,12.32 49.53,12.32 50.17,12.95 50.17,13.46 50.68,13.97 56.27,13.97 58.3,16 58.3,43.94 57.79,44.45 55.25,44.45 54.61,43.81 SV1.5
SDA  (via drill 0.6)
  Top 0.254: v44.71,45.85 44.84,45.72 44.84,45.47 45.22,45.09 51.44,45.09 JP4.5 | R3.1 10.58,9.28 Q1.3 v8.77,9.53
  Bottom 0.254: v44.71,45.85 43.95,46.61 35.95,46.61 33.91,48.64 32.52,48.64 28.33,44.45 19.44,44.45 11.43,36.45 11.43,28.83 9.28,26.67 9.28,16.13 10.42,14.99 10.42,13.97 9.66,13.21 8.77,13.21 8.26,12.7 8.26,10.54 8.01,10.29 | 8.01,10.29 JP1.2 | 8.01,10.29 v8.77,9.53
SDA_3  (via drill 0.6)
  Top 0.254: U$4.7 33.36,44.74 31.75,46.35 31.75,48.77 33.66,50.67 41.28,50.67 43.44,48.51 43.44,47.62 44.2,46.86 45.09,46.86 45.22,46.99 45.6,46.99 45.98,47.37 46.99,47.37 47.25,47.62 50.55,47.62 51.19,46.99 53.34,46.99 SV1.3 | v14.23,10.41 12.6,10.41 Q1.2 12.53,11.81 R2.1
  Bottom 0.254: v14.23,10.41 16.9,7.75 16.9,7.24 17.57,6.56 41.53,6.56 42.55,7.58 42.55,8.26 45.85,11.56 50.68,11.56 50.8,11.43 53.47,11.43 53.73,11.68 53.73,12.83 54.11,13.21 56.39,13.21 58.93,15.75 58.93,45.85 57.79,46.99 55.88,46.99 SV1.3
SPI_CE0_3  (via drill 0.5)
  Top 0.254: U1.1 42.43,25.02 43.31,24.13 43.31,22.23 45.22,20.32 v45.22,20.07 | SV1.24 56.77,20.32 55.5,19.05 v47.63,19.05
  Bottom 0.254: v47.63,19.05 46.49,19.05 45.72,19.81 45.47,19.81 v45.22,20.07
SPI_CE0_5
  Top 0.254: U1.20 34.04,25.02 33.41,24.38 32.64,24.38 31.88,25.15 31.88,25.53 29.21,28.19 29.21,29.97 24.52,34.67 24.52,38.35 23.5,39.37 11.43,39.37 8.77,36.7 8.77,34.29 8.01,33.53 6.61,33.53 5.34,32.26 5.34,29.34 4.7,28.7 2.67,28.7 1.53,27.56 1.53,23.62 JP1.8
SPI_CLK_3
  Top 0.254: U1.3 43.54,26.32 43.95,25.91 43.95,22.73 45.09,21.59 53.73,21.59 54.61,20.7 SV1.23
SPI_CLK_5  (via drill 0.5 pad 0.25)
  Top 0.254: U1.18 35.16,26.29 32.14,26.29 29.85,28.57 29.85,30.35 25.15,35.05 25.15,38.86 24.01,40.01 11.05,40.01 8.13,37.08 8.13,34.92 v7.62,34.42
  Bottom 0.254: v7.62,34.42 7.37,34.16 7.37,29.08 6.35,28.07 6.35,15.88 4.2,13.72 JP1.5
SPI_MISO_3
  Top 0.254: U1.5 44.27,27.61 45.85,26.04 49.79,26.04 50.55,25.27 50.55,24.51 50.93,24.13 53.34,24.13 SV1.21
SPI_MISO_5  (via drill 0.5 pad 0.25)
  Top 0.254: U1.16 32.71,27.61 31.12,29.21 31.12,30.86 26.42,35.56 26.42,39.5 24.64,41.27 10.29,41.27 6.35,37.34 v6.35,36.83
  Bottom 0.254: v6.35,36.83 6.74,36.45 6.74,29.46 5.72,28.45 5.72,17.53 4.45,16.26 JP1.6
SPI_MOSI_3
  Top 0.254: U1.6 44.64,28.27 46.23,26.67 52.96,26.67 54.23,25.4 SV1.19
SPI_MOSI_5  (via drill 0.5 pad 0.25)
  Top 0.254: U1.15 33.08,28.27 31.75,29.59 31.75,31.11 27.06,35.81 27.06,39.75 24.9,41.91 9.91,41.91 6.74,38.73 v6.35,38.73
  Bottom 0.254: JP1.7 5.08,20.07 5.08,28.83 6.1,29.84 6.1,35.56 5.47,36.2 5.47,37.85 v6.35,38.73
TX_3
  Top 0.254: U2.6 43.38,35.88 44.2,36.7 44.2,38.23 44.96,38.99 45.98,38.99 46.49,38.48 46.49,37.97 46.99,37.47 50.04,37.47 50.55,37.97 50.55,38.73 51.19,39.37 55.88,39.37 SV1.8 57.79,40.01 57.79,39.37 58.93,38.23 58.93,15.75 56.39,13.21 54.11,13.21 53.73,12.83 53.73,11.68 53.47,11.43 50.8,11.43 50.68,11.56 47.25,11.56 46.36,10.67 SJ1.1
TX_5
  Top 0.254: U2.15 36.27,35.88 36.83,36.45 36.83,39.24 34.93,41.15 32.01,41.15 27.44,45.72 JP2.7
VCCA  (via drill 0.5, 0.5 pad 0.25)
  Top 0.203: 43.18,49.53 44.07,48.64 | 12.53,8.68 11.43,9.78 11.43,11.21 R2.2 10.58,12.74 11.56,13.72 11.56,16 11.69,16.13 12.47,16.13 | 12.53,16.3 11.43,17.4 11.43,18.84 R4.2 | 40.09,14.56 41.49,14.56
  Top 0.254: U1.2 39.74,25.66 | 39.63,38.48 U2.10 42.16,38.48 v42.55,38.1 | U1.10 39.5,30.86 39.37,30.86 | 49.24,52.92 C3.1 49.45,52.83 | 44.54,52.83 C1.1 | 44.07,48.64 45.22,48.64 | U2.2 41.01,33.27 40.01,33.27 | C8.1 13.89,32.17 | Q1.1 12.53,8.68 | 12.53,16.3 Q2.1 12.47,16.13
  Top 0.305: 43.18,52.32 43.18,49.53 | TP2.TP 26.04,5.33 26.67,5.97 39.12,5.97 39.25,6.1
  Top 0.406: 42.68,21.72 44.2,20.19 44.2,19.68 44.84,19.05 45.72,19.05 46.99,20.32 JP3.4 | 42.68,21.72 42.68,23.75 42.04,24.38 40.14,24.38 39.74,24.78 39.74,25.66 39.37,26.04 39.37,30.86 38.36,30.86 36.45,32.77 36.45,34.04 38.23,35.81 38.23,37.08 39.63,38.48 | C1.1 43.78,52.92 43.18,52.32 | XB1.1 40.25,3.57 39.37,4.45 39.37,5.97 39.25,6.1 38.99,6.35 38.99,13.46 39.37,13.84 | 45.22,48.64 46.11,49.53 v46.74,49.53 46.99,49.78 54.36,49.78 54.61,49.53 SV1.1 | 40.01,33.27 39.5,32.77 39.5,30.86 | 13.89,32.17 C7.2 16.55,32.17 17.02,32.64 17.02,35.94 17.28,36.2 21.09,36.2 21.47,35.81 21.47,32.77 25.91,28.32 25.91,26.29 26.93,25.27 | 39.37,13.84 39.37,20.32 38.87,20.83 31.37,20.83 26.93,25.27 | 39.37,13.84 40.09,14.56 | 44.54,52.83 45.6,52.83 45.72,52.7 v45.72,52.07 | v48.26,52.07 48.26,52.7 48.39,52.83 49.45,52.83 | 41.49,14.56 41.91,14.99 41.91,20.95 42.68,21.72 | R4.2 10.58,20.36 10.93,20.7 16.01,20.7 18.04,22.73 24.13,22.73 26.67,25.27 26.93,25.27
  Bottom 0.254: 42.3,38.35 v42.55,38.1 42.3,38.1
  Bottom 0.305: 44.1,44.71 45.01,44.71 45.9,45.6
  Bottom 0.61: 42.3,38.1 41.91,38.48 41.91,43.01 43.45,44.55 43.95,44.55 44.1,44.71 | v45.72,52.07 v48.26,52.07 | v46.74,49.53 46.31,49.53 45.8,49.01 45.8,46.59 45.94,46.44 45.94,45.64 45.9,45.6
  pour Top (isolate 0.305): 6.35,0.13 6.35,22.23 22.99,22.61 27.94,27.3 33.02,27.3 33.02,48.9 59.69,48.9 59.69,11.15 arc-90 59.34,10.79 47.5,10.79 arc90 47.25,10.54 47.25,0.13
VCCB  (via drill 0.5 pad 0.25, 0.6)
  Top 0.254: v33.02,25.4 33.29,25.66 U1.19 | U$4.10 | 36.81,47.34 36.83,47.37 | U2.19 33.67,33.28 v33.28,32.89 | 25.15,25.15 v25.15,25.4 | 9.92,3.68 S1.3
  Top 0.305: U$4.10 v33.02,42.8 32.14,42.8 30.87,44.07 | U$4.1 36.45,48.65 36.83,48.26 36.83,47.37 36.83,43.18 36.45,42.8 U$4.10 | U$4.3 36.81,47.34 | TP3.TP 29.21,3.17 28.71,2.67 19.82,2.67 19.56,2.41 17.53,2.41 17.28,2.67 17.28,3.94 16.26,4.95 16.01,4.95 13.85,7.11
  Top 0.406: R5.2 13.34,14.61 13.97,13.97 13.97,11.94 14.36,11.56 14.61,11.56 15.24,10.92 15.24,9.91 14.1,8.76 14.1,7.37 13.85,7.11 13.72,6.99 R3.2 12.28,5.17 11.94,4.83 11.94,4.06 11.56,3.68 9.92,3.68 | 30.48,44.7 30.61,44.58 30.61,44.32 30.87,44.07 | ON.2 29.21,3.94 TP3.TP
  Top 0.61: C2.1 46.99,53.47 | 46.99,53.47 47.63,54.1 51.69,54.1 52.07,53.72 C4.1 | 46.99,53.47 46.36,54.1 43.18,54.1 42.17,53.09 42.17,51.82 41.91,51.56 33.28,51.56 30.74,49.02 30.74,46.74 30.48,46.48 30.48,44.7 | 8.26,15.11 8.26,13.84
  Top 0.813: 8.26,15.11 8.26,21.08 8.77,21.59 15.63,21.59 17.66,23.62 23.63,23.62 25.15,25.15 | 8.26,13.84 8.26,11.05 6.86,9.65 6.86,5.71 7.88,4.7 9.4,4.7 9.82,4.28 S1.3
  Bottom 0.813: v25.15,25.4 v33.02,25.4 | JP3.5 50.68,22.86 49.41,21.59 43.44,21.59 40.14,24.89 33.53,24.89 v33.02,25.4 | v33.02,25.4 33.02,25.65 32.52,26.16 32.52,32.13 v33.28,32.89 32.39,33.78 32.39,39.24 33.02,39.88 v33.02,42.8
  pour Top (isolate 0.305): 15.24,23.5 15.24,45.09 31.75,45.09 31.75,28.57 27.94,28.57 22.86,23.5
  pour Bottom (isolate 0.305): 5.08,0.13 5.08,33.66 17.78,46.35 21.59,46.35 24.13,48.9 33.02,48.9 33.02,24.77 40.64,24.77 43.18,22.23 59.69,22.23 59.69,11.15 arc-90 59.34,10.79 47.5,10.79 arc90 47.25,10.54 47.25,0.13

### Text on the board
Bottom: Rev1.0 | Fab B
tPlace: 0 | 1 | 2 | 3 | 4 | 5 | 6 | 7 | 8 | 9 | 10 | 11 | GPIO07 | 12 | PIN26 | 13 | On | GND | 3V3 | 5V
tNames: RX | SCL | TX | 1 | SDA | A3 | A2 | A1 | # | ANALOG | A0 | # | GND | 3V3 | 5V | GND | ARF
bNames: Raspberry - Arduino | www.hetpro.com | HDRA2381
201tbmp: www.hetpro.com.mx
204bmp: 1_3v3 / 2_5v / 3_GPIO00_SDA / 4_5V / 5_GPIO01_SCL / 6_GND / 7_GPIO04 / 8_GPIO14_TX / 9_GND / 10_GPIO15_RX / 11_GPIO17 / 12_GPIO18_PWM0 / 13_GPIO21/27 / 14_GND / 15_GPIO22 / 16_GPIO23 / 17_3V3 / 18_GPIO24 / 19_GPIO10_MOSI / 20_GND / 21_GPIO09_MISO / 22_GPIO25 / 23_GPIO11_SCK / 24_GPIO08_CE0 / 25_GND / 26_GPIO07_CE1 | 1_3v3 / 2_5v / 3_SDA / 4_nc / 5_SCL / 6_GND / 7_D6 / 8_D1_TX / 9_nc / 10_D0_RX / 11_D7 / 12_D2 / 13_D8 / 14_nc / 15_D9 / 16_D3 / 17_nc / 18_D4 / 19_D11 / 20_nc / 21_D12 / 22_D5 / 23_D13 / 24_D10 / 25_nc / 26_nc | 3_GPIO00_SDA--- / 5_GPIO01_SCL--- / 7_GPIO04------- / 8_GPIO14_TX---- / 10_GPIO15_RX--- / 11_GPIO17------ / 12_GPIO18_PWM0- / 13_GPIO21/27--- / 15_GPIO22------ / 16_GPIO23------ / 18_GPIO24------ / 19_GPIO10_MOSI- / 21_GPIO09_MISO- / 22_GPIO25------ / 23_GPIO11_SCK-- / 24_GPIO08_CE0-- | A4 / A5 / D6 / D1 / D0 / D7 / D2 / D8 / D9 / D3 / D4 / D11 / D12 / D5 / D13 / D10